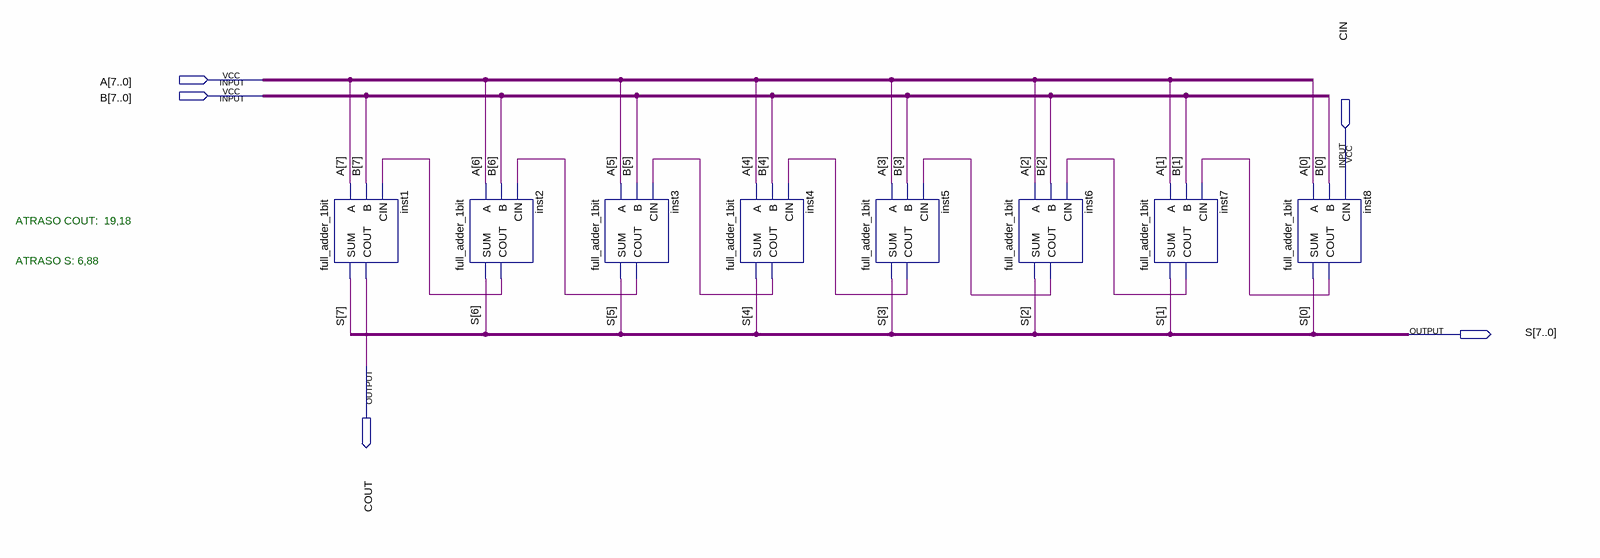
[diagram p0: schematic sheet]
// Quartus schematic full_adder_8bit.bdf as structural Verilog: 8 symbols, 5 pins
module full_adder_8bit (
  input  [7:0] A,
  input  [7:0] B,
  input  CIN,
  output [7:0] S,
  output COUT
);

  wire inst2_cout, inst3_cout, inst4_cout, inst5_cout, inst6_cout, inst7_cout, inst8_cout;

  full_adder_1bit inst1 (.A(A[7]), .B(B[7]), .CIN(inst2_cout), .SUM(S[7]), .COUT(COUT));
  full_adder_1bit inst2 (.A(A[6]), .B(B[6]), .CIN(inst3_cout), .SUM(S[6]), .COUT(inst2_cout));
  full_adder_1bit inst3 (.A(A[5]), .B(B[5]), .CIN(inst4_cout), .SUM(S[5]), .COUT(inst3_cout));
  full_adder_1bit inst4 (.A(A[4]), .B(B[4]), .CIN(inst5_cout), .SUM(S[4]), .COUT(inst4_cout));
  full_adder_1bit inst5 (.A(A[3]), .B(B[3]), .CIN(inst6_cout), .SUM(S[3]), .COUT(inst5_cout));
  full_adder_1bit inst6 (.A(A[2]), .B(B[2]), .CIN(inst7_cout), .SUM(S[2]), .COUT(inst6_cout));
  full_adder_1bit inst7 (.A(A[1]), .B(B[1]), .CIN(inst8_cout), .SUM(S[1]), .COUT(inst7_cout));
  full_adder_1bit inst8 (.A(A[0]), .B(B[0]), .CIN(CIN), .SUM(S[0]), .COUT(inst8_cout));

  // Notes on the sheet:
  //   ATRASO COUT:  19,18
  //   ATRASO S: 6,88
endmodule
